# EAGLE schematic asomator1 (EAGLE 7.7.0)
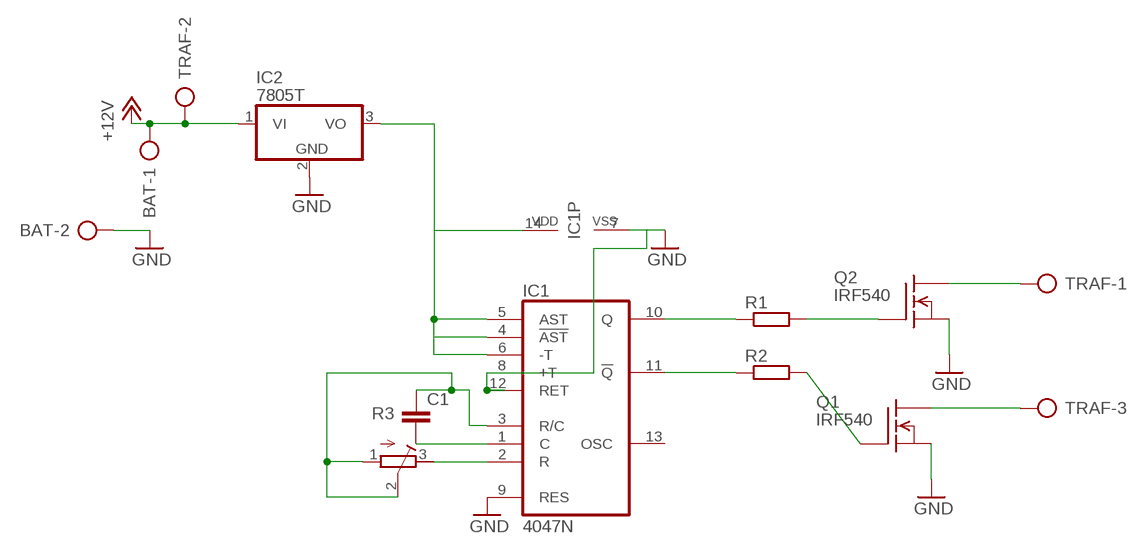
[diagram p0: schematic, sheet 1]

## Parts
BAT  AK500/2-H  [AK500/2-H]
C1  C-EU025-030X050  [C025-030X050]
IC1  4047N  [DIL14]
IC2  7805T  [TO220H]
Q1  IRF540  [TO220]
Q2  IRF540  [TO220]
R1  R-EU_0204/7  [0204/7]
R2  R-EU_0204/7  [0204/7]
R3  R-TRIMM64P  [RTRIM64P]
TRAF  AK500/3-H  [AK500/3-H]

## Nets
5V: IC1.4(!AST) IC1.5(AST) IC1.6(-T) IC1.14(VDD) IC2.3(VO)
+12V: BAT.1 IC2.1(VI) TRAF.2
GND: BAT.2 IC1.7(VSS) IC1.8(+T) IC1.9(RES) IC1.12(RET) IC2.2(GND) Q1.3(S) Q2.3(S)
N$1: IC1.10(Q) R1.1
N$2: Q2.1(G) R1.2
N$3: IC1.11(!Q) R2.1
N$4: Q1.1(G) R2.2
N$5: Q1.2(D) TRAF.3
N$6: Q2.2(D) TRAF.1
N$7: IC1.2(R) R3.3(E)
N$8: C1.2 IC1.1(C)
N$9: C1.1 IC1.3(R/C) R3.1(A) R3.2(S)
Unconnected: IC1.13(OSC)

## Library data of the parts
BAT = con-ptr500:AK500/2-H: CONNECTOR Aug. 2004 / PTR Meßtechnik: Die Bezeichnung der Serie AK505 wurde geändert. Es handelt sich hierbei um AK500 in horizontaler Ausführung.; OC_FARNELL: unknown; OC_NEWARK: unknown
C1 = rcl:C-EU: CAPACITOR, European symbol
IC1 = 40xx:4047: LP monostable/astable MULTIVIBRATOR
IC2 = linear:78*: Positive VOLTAGE REGULATOR Source: http://cache.national.com/ds/LM/LM78L05.pdf http://www.fairchildsemi.com/ds/LM/LM7805.pdf
Q1 Q2 = transistor-fet:IRF540: N-Channel Enhancement MOSFET (HEXFET); 100V; 28A; 0,077Ohm
R1 R2 = rcl:R-EU_: RESISTOR, European symbol
R3 = resistor:R-TRIMM: Trimm resistor
TRAF = con-ptr500:AK500/3-H: CONNECTOR Aug. 2004 / PTR Meßtechnik: Die Bezeichnung der Serie AK505 wurde geändert. Es handelt sich hierbei um AK500 in horizontaler Ausführung.; OC_FARNELL: unknown; OC_NEWARK: unknown